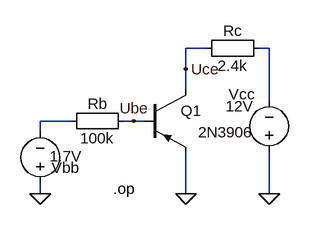
[diagram p0: schematic ce-active-pnp.asc]
ce-active-pnp.asc, the LTspice schematic file:
Version 4
SHEET 1 880 680
WIRE 240 16 208 16
WIRE 336 16 320 16
WIRE 208 48 208 16
WIRE 208 80 208 48
WIRE 336 96 336 16
WIRE 32 128 -16 128
WIRE 128 128 112 128
WIRE 144 128 128 128
WIRE -16 144 -16 128
WIRE -16 240 -16 224
WIRE 208 240 208 176
WIRE 336 240 336 176
FLAG 208 240 0
FLAG -16 240 0
FLAG 336 240 0
FLAG 128 128 Ube
FLAG 208 48 Uce
SYMBOL Misc\\EuropeanResistor 336 0 R90
WINDOW 0 5 56 VBottom 2
WINDOW 3 27 56 VTop 2
SYMATTR InstName Rc
SYMATTR Value 2.4k
SYMBOL Misc\\EuropeanResistor 128 112 R90
WINDOW 0 5 56 VBottom 2
WINDOW 3 27 56 VTop 2
SYMATTR InstName Rb
SYMATTR Value 100k
SYMBOL voltage -16 240 R180
WINDOW 3 -64 58 Left 2
WINDOW 123 0 0 Left 2
WINDOW 39 0 0 Left 2
WINDOW 0 -60 40 Left 2
SYMATTR Value 1.7V
SYMATTR InstName Vbb
SYMBOL voltage 336 192 R180
WINDOW 3 24 87 Left 2
WINDOW 123 0 0 Left 2
WINDOW 39 0 0 Left 2
WINDOW 0 22 105 Left 2
SYMATTR Value 12V
SYMATTR InstName Vcc
SYMBOL pnp 144 80 R0
WINDOW 3 83 65 Left 2
SYMATTR InstName Q1
SYMATTR Value 2N3906
TEXT 96 232 Left 2 !.op

The netlist it stands for:
* ce-active-pnp.asc
Rc N001 Uce 2.4k
Rb Ube N002 100k
Vbb 0 N002 1.7V
Vcc 0 N001 12V
Q1 Uce Ube 0 0 2N3906
.model NPN NPN
.model PNP PNP
.lib standard.bjt
.op
.backanno
.end